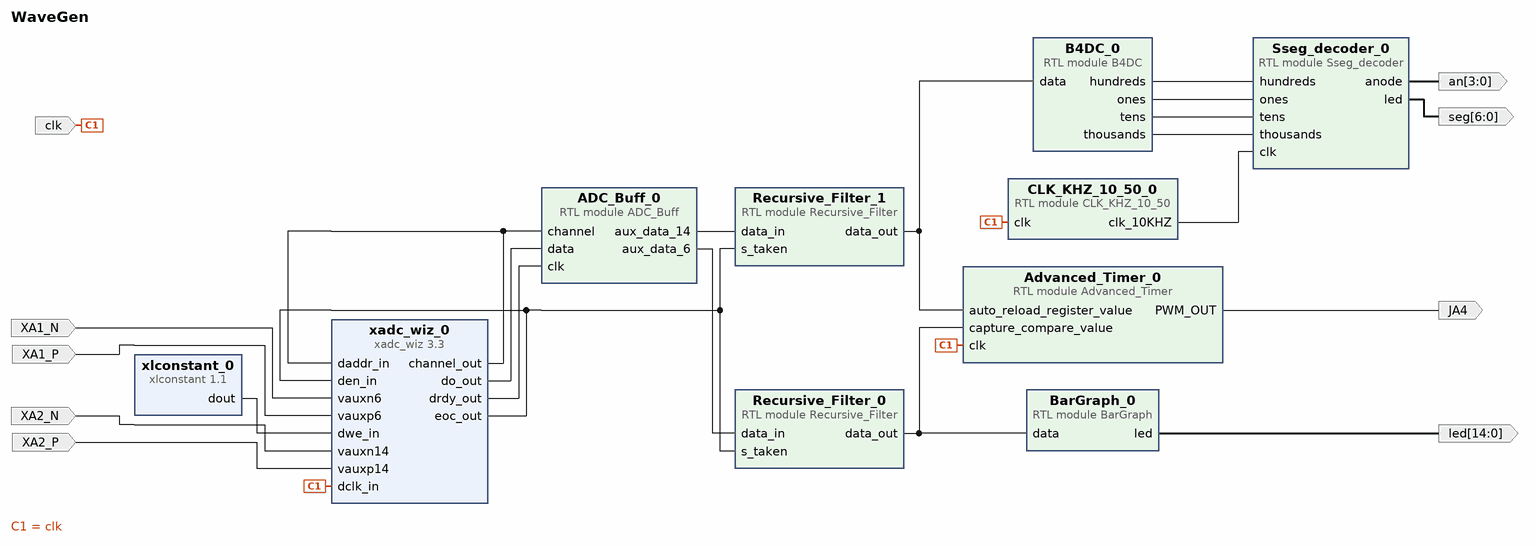
[diagram p0: block diagram of the top level]
# Vivado block design WaveGen, xc7a35tcpg236-1, Vivado 2023.2
create_bd_design WaveGen

create_bd_port -dir O -from 3 -to 0 an
create_bd_port -dir O -from 6 -to 0 seg
create_bd_port -dir I XA1_N
create_bd_port -dir I XA1_P
create_bd_port -dir O -from 14 -to 0 led
create_bd_port -dir I -type clk clk
set_property -dict {CONFIG.FREQ_HZ 100000000} [get_bd_ports clk]
create_bd_port -dir I XA2_N
create_bd_port -dir I XA2_P
create_bd_port -dir O JA4

create_bd_cell -type module -reference Sseg_decoder Sseg_decoder_0
create_bd_cell -type ip -vlnv xilinx.com:ip:xadc_wiz:3.3 xadc_wiz_0
set_property -dict [list \
  CONFIG.ADC_OFFSET_AND_GAIN_CALIBRATION false \
  CONFIG.BIPOLAR_VAUXP14_VAUXN14 false \
  CONFIG.BIPOLAR_VAUXP6_VAUXN6 false \
  CONFIG.CHANNEL_ENABLE_CALIBRATION false \
  CONFIG.CHANNEL_ENABLE_VAUXP12_VAUXN12 false \
  CONFIG.CHANNEL_ENABLE_VAUXP13_VAUXN13 false \
  CONFIG.CHANNEL_ENABLE_VAUXP14_VAUXN14 true \
  CONFIG.CHANNEL_ENABLE_VAUXP6_VAUXN6 true \
  CONFIG.CHANNEL_ENABLE_VAUXP7_VAUXN7 false \
  CONFIG.CHANNEL_ENABLE_VP_VN false \
  CONFIG.ENABLE_CALIBRATION_AVERAGING false \
  CONFIG.ENABLE_RESET false \
  CONFIG.EXTERNAL_MUX_CHANNEL VP_VN \
  CONFIG.INTERFACE_SELECTION ENABLE_DRP \
  CONFIG.OT_ALARM false \
  CONFIG.SENSOR_OFFSET_AND_GAIN_CALIBRATION false \
  CONFIG.SEQUENCER_MODE Continuous \
  CONFIG.SIM_FILE_NAME ADC_Sim_Data \
  CONFIG.SIM_FILE_REL_PATH "C:\\Xilinx\\Projects\\WaveGen" \
  CONFIG.SIM_FILE_SEL Relative_path \
  CONFIG.SINGLE_CHANNEL_SELECTION TEMPERATURE \
  CONFIG.TIMING_MODE Continuous \
  CONFIG.USER_TEMP_ALARM false \
  CONFIG.VCCAUX_ALARM false \
  CONFIG.VCCINT_ALARM false \
  CONFIG.XADC_STARUP_SELECTION channel_sequencer \
] [get_bd_cells xadc_wiz_0]
create_bd_cell -type ip -vlnv xilinx.com:ip:xlconstant:1.1 xlconstant_0
set_property -dict {CONFIG.CONST_VAL 0} [get_bd_cells xlconstant_0]
create_bd_cell -type module -reference ADC_Buff ADC_Buff_0
create_bd_cell -type module -reference B4DC B4DC_0
create_bd_cell -type module -reference CLK_KHZ_10_50 CLK_KHZ_10_50_0
create_bd_cell -type module -reference BarGraph BarGraph_0
create_bd_cell -type module -reference Recursive_Filter Recursive_Filter_0
set_property -dict {CONFIG.Decimation 10000} [get_bd_cells Recursive_Filter_0]
create_bd_cell -type module -reference Recursive_Filter Recursive_Filter_1
set_property -dict {CONFIG.Decimation 10000} [get_bd_cells Recursive_Filter_1]
create_bd_cell -type module -reference Advanced_Timer Advanced_Timer_0
set_property -dict {CONFIG.Period_Max 10000 CONFIG.clk_divider_value 1 CONFIG.prescaler_value 250} [get_bd_cells Advanced_Timer_0]

# ---- connections ----

connect_bd_net [get_bd_pins ADC_Buff_0/aux_data_14] [get_bd_pins Recursive_Filter_1/data_in]
connect_bd_net [get_bd_pins Advanced_Timer_0/PWM_OUT] [get_bd_ports JA4]
connect_bd_net [get_bd_pins B4DC_0/hundreds] [get_bd_pins Sseg_decoder_0/hundreds]
connect_bd_net [get_bd_pins B4DC_0/ones] [get_bd_pins Sseg_decoder_0/ones]
connect_bd_net [get_bd_pins B4DC_0/tens] [get_bd_pins Sseg_decoder_0/tens]
connect_bd_net [get_bd_pins B4DC_0/thousands] [get_bd_pins Sseg_decoder_0/thousands]
connect_bd_net [get_bd_pins BarGraph_0/led] [get_bd_ports led]
connect_bd_net [get_bd_pins CLK_KHZ_10_50_0/clk_10KHZ] [get_bd_pins Sseg_decoder_0/clk]
connect_bd_net [get_bd_pins xadc_wiz_0/eoc_out] \
  [get_bd_pins xadc_wiz_0/den_in] [get_bd_pins Recursive_Filter_0/s_taken] [get_bd_pins Recursive_Filter_1/s_taken]
connect_bd_net [get_bd_pins ADC_Buff_0/aux_data_6] [get_bd_pins Recursive_Filter_0/data_in]
connect_bd_net [get_bd_pins Recursive_Filter_0/data_out] [get_bd_pins Advanced_Timer_0/capture_compare_value] [get_bd_pins BarGraph_0/data]
connect_bd_net [get_bd_pins Recursive_Filter_1/data_out] [get_bd_pins Advanced_Timer_0/auto_reload_register_value] [get_bd_pins B4DC_0/data]
connect_bd_net -net Sseg_decoder_0_annode [get_bd_pins Sseg_decoder_0/anode] [get_bd_ports an]
connect_bd_net [get_bd_pins Sseg_decoder_0/led] [get_bd_ports seg]
connect_bd_net [get_bd_ports XA1_N] [get_bd_pins xadc_wiz_0/vauxn6]
connect_bd_net [get_bd_ports XA1_P] [get_bd_pins xadc_wiz_0/vauxp6]
connect_bd_net [get_bd_ports XA2_N] [get_bd_pins xadc_wiz_0/vauxn14]
connect_bd_net [get_bd_ports XA2_P] [get_bd_pins xadc_wiz_0/vauxp14]
connect_bd_net [get_bd_ports clk] [get_bd_pins xadc_wiz_0/dclk_in] [get_bd_pins CLK_KHZ_10_50_0/clk] [get_bd_pins Advanced_Timer_0/clk]
connect_bd_net [get_bd_pins xadc_wiz_0/channel_out] [get_bd_pins xadc_wiz_0/daddr_in] [get_bd_pins ADC_Buff_0/channel]
connect_bd_net [get_bd_pins xadc_wiz_0/do_out] [get_bd_pins ADC_Buff_0/data]
connect_bd_net [get_bd_pins xadc_wiz_0/drdy_out] [get_bd_pins ADC_Buff_0/clk]
connect_bd_net [get_bd_pins xlconstant_0/dout] [get_bd_pins xadc_wiz_0/dwe_in]

set_property USER_COMMENTS.comment_7 0-1V [current_bd_design]

validate_bd_design
save_bd_design
